# Altium schematic sheet ESP8266控制器.SchDoc: ESP8266控制器
size A4; Organization: 修订内容; Address1: 1、增加logo; Address2: 2、修改接口; DocumentNumber: 1; Revision: V3; SheetNumber: 1; SheetTotal: 1
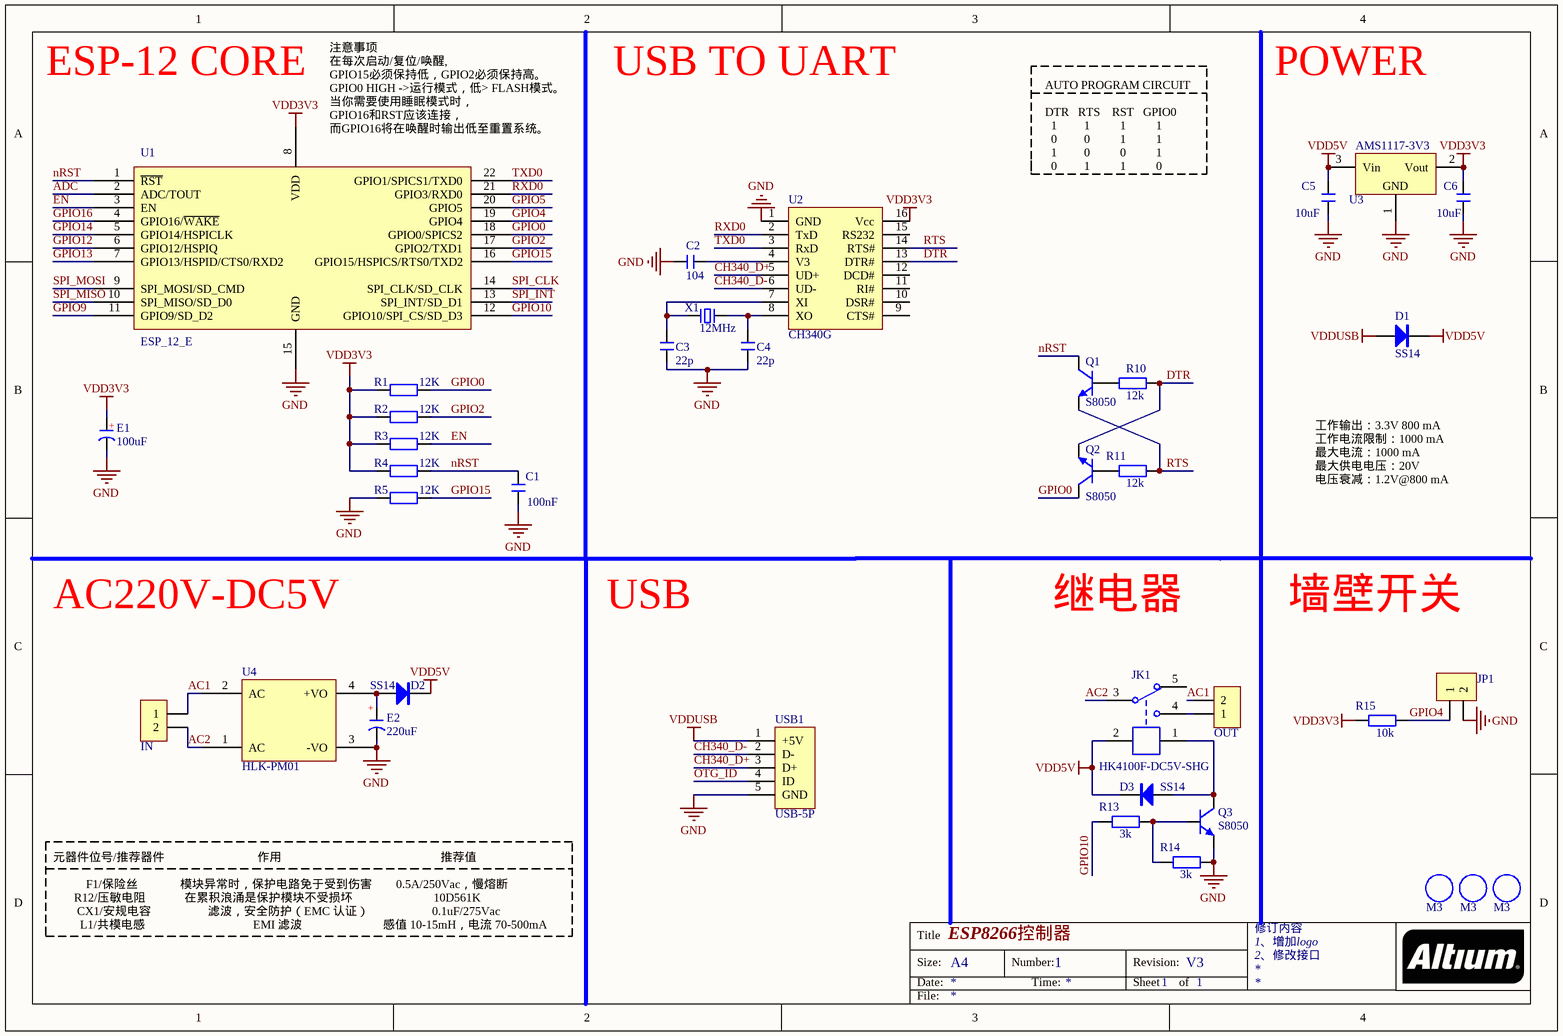
[diagram p0: ESP8266控制器.SchDoc]

## Parts
1  M3  [M3 125X200]
2  M3  [M3 125X200]
3  M3  [M3 125X200]
C1  100nF  [C 0603_M]
C2  104  [C 0603_M]
C3  22p  [C 0603_M]
C4  22p  [C 0603_M]
C5  10uF  [C 0603_M]
C6  10uF  [C 0603_M]
D1  SS14  [SMA]
D2  SS14  [SMA]
D3  SS14  [SMA]
E1  100uF  [CD D(7343)]
E2  220uF  [CD D(7343)]
IN  HDR-1X2  [KF301-5.0-2P]  (value not drawn)
JK1  HK4100F-DC5V-SHG  [HK4100F]
JP1  HDR-1X2  [KF350-2P]  (value not drawn)
OUT  HDR-1X2  [KF301-5.0-2P]  (value not drawn)
Q1  S8050  [SOT23-3N]
Q2  S8050  [SOT23-3N]
Q3  S8050  [SOT23-3N]
R1  12K  [R 0603_M]
R2  12K  [R 0603_M]
R3  12K  [R 0603_M]
R4  12K  [R 0603_M]
R5  12K  [R 0603_M]
R10  12k  [R 0603_M]
R11  12k  [R 0603_M]
R13  3k  [R 0603_M]
R14  3k  [R 0603_M]
R15  10k  [R 0603_M]
U1  ESP_12_E  [ESP_12_E_L]
U2  CH340G  [SOP16_L]
U3  AMS1117-3V3  [SOT223_L]
U4  HLK-PM01  [HLK-PM01]
USB1  USB-5P  [USB-MICRO_D]
X1  12MHz  [OSC HC-49S]

## Nets
GND: C1.1 C2.2 C3.2 C4.2 C5.2 C6.2 E1.2(K) E2.2(K) JP1.2 Q3.2(E) R5.1 R14.1 U1.15(GND) U2.1(GND) U3.1(GND) U4.3(-VO) USB1.5(GND)
VDD3V3: C6.1 E1.1(A) R1.1 R2.1 R3.1 R4.1 R15.2 U1.8(VDD) U2.16(Vcc) U3.2(Vout)
VDD5V: C5.1 D1.2(K) D2.2(K) D3.2(K) JK1.2 U3.3(Vin)
VDDUSB: D1.1(A) USB1.1(+5V)
AC1: IN.1 OUT.2 U4.2(AC)
AC2: IN.2 JK1.3 U4.1(AC)
ADC: U1.2(ADC/TOUT)
CH340_D+: U2.5(UD+) USB1.3(D+)
CH340_D-: U2.6(UD-) USB1.2(D-)
DTR: Q2.2(E) R10.1 U2.13(DTR#)
EN: R3.2 U1.3(EN)
GPIO0: Q2.3(C) R1.2 U1.18(GPIO0/SPICS2)
GPIO2: R2.2 U1.17(GPIO2/TXD1)
GPIO4: JP1.1 R15.1 U1.19(GPIO4)
GPIO5: U1.20(GPIO5)
GPIO9: U1.11(GPIO9/SD_D2)
GPIO10: R13.2 U1.12(GPIO10/SPI_CS/SD_D3)
GPIO12: U1.6(GPIO12/HSPIQ)
GPIO13: U1.7(GPIO13/HSPID/CTS0/RXD2)
GPIO14: U1.5(GPIO14/HSPICLK)
GPIO15: R5.2 U1.16(GPIO15/HSPICS/RTS0/TXD2)
GPIO16: U1.4(GPIO16/~{WAKE})
nRST: C1.2 Q1.3(C) R4.2 U1.1(~{RST})
OTG_ID: USB1.4(ID)
RTS: Q1.2(E) R11.1 U2.14(RTS#)
RXD0: U1.21(GPIO3/RXD0) U2.2(TxD)
SPI_CLK: U1.14(SPI_CLK/SD_CLK)
SPI_INT: U1.13(SPI_INT/SD_D1)
SPI_MISO: U1.10(SPI_MISO/SD_D0)
SPI_MOSI: U1.9(SPI_MOSI/SD_CMD)
TXD0: U1.22(GPIO1/SPICS1/TXD0) U2.3(RxD)
NetC2_1: C2.1 U2.4(V3)
NetC3_1: C3.1 U2.7(XI) X1.1
NetC4_1: C4.1 U2.8(XO) X1.2
NetD2_1: D2.1(A) E2.1(A) U4.4(+VO)
NetD3_1: D3.1(A) JK1.1 Q3.3(C)
NetJK1_4: JK1.4 OUT.1
NetQ1_1: Q1.1(B) R10.2
NetQ2_1: Q2.1(B) R11.2
NetQ3_1: Q3.1(B) R13.1 R14.2

Not connected (* = marked no-connect by the designer): JK1 5; U2 9(CTS#) 10(DSR#) 11(RI#) 12(DCD#) 15(RS232)

## Notes on the sheet
- ESP-12 CORE
- USB TO UART
- POWER
- (near U1) 注意事项
  在每次启动/复位/唤醒,
  GPIO15必须保持低，GPIO2必须保持高。
  GPIO0 HIGH ->运行模式，低> FLASH模式。
  当你需要使用睡眠模式时，
  GPIO16和RST应该连接，
  而GPIO16将在唤醒时输出低至重置系统。
- AUTO PROGRAM CIRCUIT
  DTR   RTS    RST   GPIO0
  1         1          1          1
  0         0          1          1
  1         0          0          1
  0         1          1          0
- 工作输出：3.3V 800 mA
  工作电流限制：1000 mA
  最大电流：1000 mA
  最大供电电压：20V
  电压衰减：1.2V@800 mA
- AC220V-DC5V
- USB
- 继电器
- 墙壁开关
- 元器件位号/推荐器件                               作用                                                     推荐值
  F1/保险丝              模块异常时，保护电路免于受到伤害        0.5A/250Vac，慢熔断
  R12/压敏电阻             在累积浪涌是保护模块不受损坏                           10D561K
  CX1/安规电容                   滤波，安全防护（EMC 认证）                     0.1uF/275Vac
  L1/共模电感                                    EMI 滤波                           感值 10-15mH，电流 70-500mA
- Title
- Size:
- Date:
- A4
- Number:
- Time:
- Revision:
- Sheet
- of
- File:
- (in symbol C-CD) +

## Library data of the parts
1-3 = M3: 铜柱孔; 版权归属: 源创客; BOM名称: 铜柱孔; 学习资源: www.ooocke.com
C1-C6 = C: 无极性贴片电容; 版权归属: 源创客; BOM名称: 无极性贴片电容; 学习资源: www.ooocke.com
D1-D3 = SS14: 肖特基二极管; 版权归属: 源创客; 属性: 40V/1A; BOM名称: 肖特基二极管; 学习资源: www.ooocke.com
E1 E2 = C-CD: 贴片钽电容; 版权归属: 源创客; BOM名称: 贴片钽电容; 学习资源: www.ooocke.com
IN OUT = Header 2 5.0: 2P接插件; 版权归属: 源创客; BOM名称: 2P接插件; 学习资源: www.ooocke.com
JK1 = HK4100F: 一组转换; BOM名称: 一组继电器; 版权归属: 源创客; 学习资源: www.ooocke.com
JP1 = Header 2 3.5: 2P接插件; 版权归属: 源创客; BOM名称: 2P接插件; 学习资源: www.ooocke.com
Q1-Q3 = 8050-SMD: 高频放大-NPN型; 版权归属: 源创客; 属性: 40V 1.5A 1W 100MHZ; BOM名称: 高频放大-NPN型; 学习资源: www.ooocke.com
R1-R5 R10 R11 R13-R15 = R: 贴片电阻; 版权归属: 源创客; BOM名称: 贴片电阻; 学习资源: www.ooocke.com
U1 = ESP_12_E: ESP-12 Wi-Fi Module by AI-Thinker; IC: ESP8266-EX; Vendor: Ai-thinker
U2 = CH340G: 串口转USB; 版权归属: 源创客; BOM名称: 串口转USB; 学习资源: www.ooocke.com
U3 = AMS1117: 三端稳压芯片; BOM名称: 稳压芯片; 版权归属: 源创客; 学习资源: www.ooocke.com
U4 = Component_1: 220V转5V模块
USB1 = USB-5P: 微型USB母座; 版权归属: 源创客; BOM名称: 微型USB母座; 学习资源: www.ooocke.com
X1 = XTAL-2P: 2脚无源脚晶振; 版权归属: 源创客; BOM名称: 2脚无源脚晶振; 学习资源: www.ooocke.com